# EAGLE design pcb for ps (EAGLE 9.6.2)
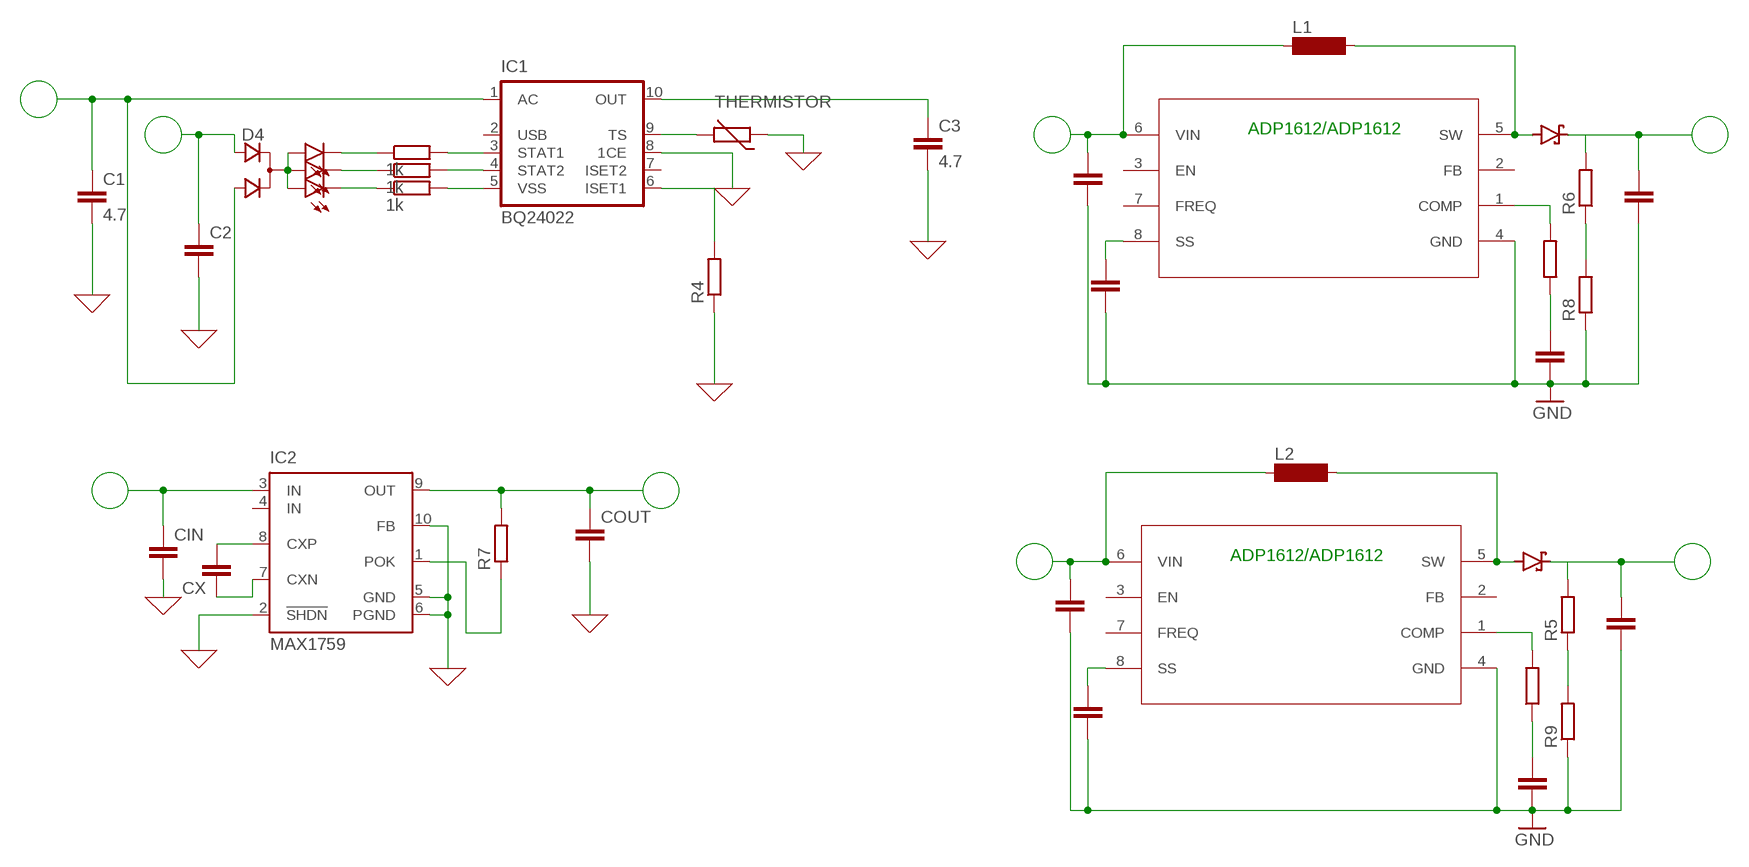
[diagram p0: schematic, sheet 1]

## Parts
C1  4.7  C2,5-3  [C2.5-3]
C2  C2,5-3  [C2.5-3]
C3  4.7  C2,5-3  [C2.5-3]
C4  C2,5-3  [C2.5-3]
C5  C2,5-3  [C2.5-3]
C6  C2,5-3  [C2.5-3]
C7  C2,5-3  [C2.5-3]
CIN  C2,5-3  [C2.5-3]
COUT  C2,5-3  [C2.5-3]
CSS  C2,5-3  [C2.5-3]
CSS1  C2,5-3  [C2.5-3]
CX  C2,5-3  [C2.5-3]
D1  SFH482  [SFH482]
D2  SFH482  [SFH482]
D3  SFH482  [SFH482]
D4  D_2ASOT23  [SOT-23]
D5  BAS40  [SOT23]
D6  BAS40  [SOT23]
IC1  BQ24022  [DRC-S-PVSON-N10]
IC2  MAX1759  [UMAX10]
IN  C2,5-3  [C2.5-3]
IN1  C2,5-3  [C2.5-3]
L1  BS11  [BS11]
L2  BS11  [BS11]
R1  1k  R-EU_0204/2V  [0204V]
R2  1k  R-EU_0204/2V  [0204V]
R3  1k  R-EU_0204/2V  [0204V]
R4  R-EU_0204/2V  [0204V]
R5  R-EU_0204/2V  [0204V]
R6  R-EU_0204/2V  [0204V]
R7  R-EU_0204/2V  [0204V]
R8  R-EU_0204/2V  [0204V]
R9  R-EU_0204/2V  [0204V]
RCOMP  R-EU_0204/2V  [0204V]
RCOMP1  R-EU_0204/2V  [0204V]
THERMISTOR  THERMISTOR_R-2,5  [RS-2,5]
U1  ADP1612  [RM_8_ADI]
U2  ADP1612  [RM_8_ADI]

## Nets
0: CIN.2 COUT.2 IC2.2(!SHDN) IC2.5(GND) IC2.6(PGND) IC2.10(FB) ; supply symbol labelled GND
GND: C4.2 C5.2 C6.2 C7.2 CSS1.2 CSS.2 IN1.2 IN.2 R8.1 R9.1 U1.4(GND) U2.4(GND)
N$1: C1.1 D4.3(A2) IC1.1(AC)
N$2: C2.1 D4.2(A1)
N$3: D1.A D2.A D3.A D4.1(C)
N$4: D1.K(C) R1.1
N$5: D2.K(C) R2.1
N$6: D3.K(C) R3.1
N$7: IC1.3(STAT1) R1.2
N$8: IC1.4(STAT2) R2.2
N$9: IC1.5(VSS) R3.2
N$10: IC1.9(TS) THERMISTOR.2
N$11: IN.1 L1.1 U1.6(VIN)
N$12: D5.1(A) L1.2 U1.5(SW)
N$13: IC1.6(ISET1) R4.2
N$14: C3.1 IC1.10(OUT)
N$15: IN1.1 L2.1 U2.6(VIN)
N$16: C6.1 RCOMP.1
N$17: RCOMP.2 U1.1(COMP)
N$18: CSS.1 U1.8(SS)
N$19: R6.2
N$20: C7.1 D5.3(C)
N$21: R6.1 R8.2
N$22: D6.1(A) L2.2 U2.5(SW)
N$23: CIN.1 IC2.3(IN)
N$24: CX.2 IC2.8(CXP)
N$25: CX.1 IC2.7(CXN)
N$26: COUT.1 IC2.9(OUT) R7.2
N$27: IC2.1(POK) R7.1
N$28: C4.1 RCOMP1.1
N$29: RCOMP1.2 U2.1(COMP)
N$30: CSS1.1 U2.8(SS)
N$31: R5.2
N$32: C5.1 D6.3(C)
N$33: R5.1 R9.2
THERMISTOR: C1.2 C2.2 C3.2 IC1.8(1CE) R4.1 THERMISTOR.1 ; supply symbol labelled GND
Unconnected: IC1.2(USB) IC1.7(ISET2) IC1.TH IC2.4(IN) U1.2(FB) U1.3(EN) U1.7(FREQ) U2.2(FB) U2.3(EN) U2.7(FREQ)

## Notes on the sheet
- ADP1612/ADP1612
- ADP1612/ADP1612

## Library data of the parts
C1-C7 CIN COUT CSS CSS1 CX IN IN1 = capacitor-wima:C: CAPACITOR naming: grid - package width
D1-D3 = led:SFH482: IR LED infrared emitting diode, Infineon
D4 = zetex:D_2A: Dual DIODE; OC_FARNELL: unknown; OC_NEWARK: unknown
D5 D6 = diode:BAS40: Silicon Schottky Diodes General-purpose diode for high-speed switching
IC1 = texas:BQ24022: SINGLE-CHIP, LI-ION AND LI-POL CHARGER IC WITH AUTONOMOUS USB-PORT AND AC-ADAPTER SUPPLY MANAGEMENT (bqTINY™-II) Source: bq24022.pdf (www.ti.com)
IC2 = maxim:MAX1759: Buck/Boost Regulating Charge Pump in µMAX Source: http://www.maxim-ic.com .. MAX1759.pdf; MF: MAXIM; MPN: MAX1759EUB+; OC_FARNELL: 1593325; OC_NEWARK: 61H9447
L1 L2 = inductor-neosid:BS: INDUCTOR nominal inductance, magnetically screened; OC_FARNELL: unknown; OC_NEWARK: unknown
R1-R9 RCOMP RCOMP1 = rcl:R-EU_: RESISTOR, European symbol; SPICEPREFIX: R
THERMISTOR = discrete:THERMISTOR_: Thermo Resistor
U1 U2 = ultra librarian:ADP1612: ADP 1612/1613 , ADP 1612, ADP1613, DC - DC step up converter; BUILT_BY: EMA_UL_Team; MANUFACTURER_PART_NUMBER: ADP1612ARMZ-R7; SOURCELIBRARY: Analog_2015-12-15; VENDOR: Analog Devices Inc

## Board
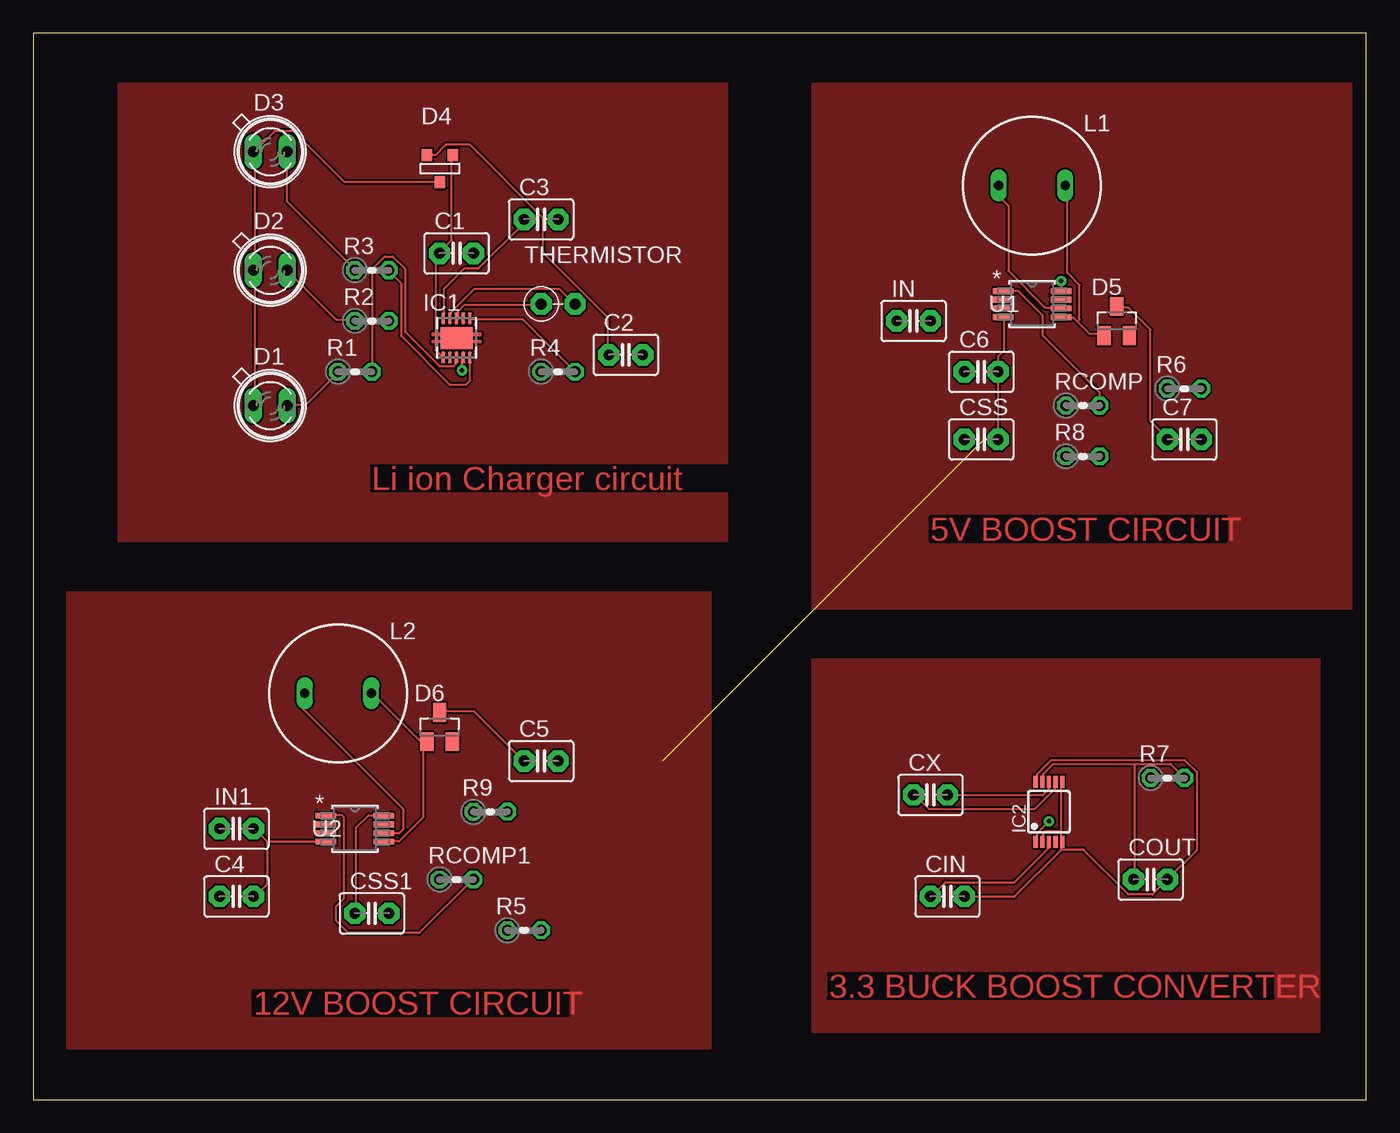
[diagram p1: board, top side]
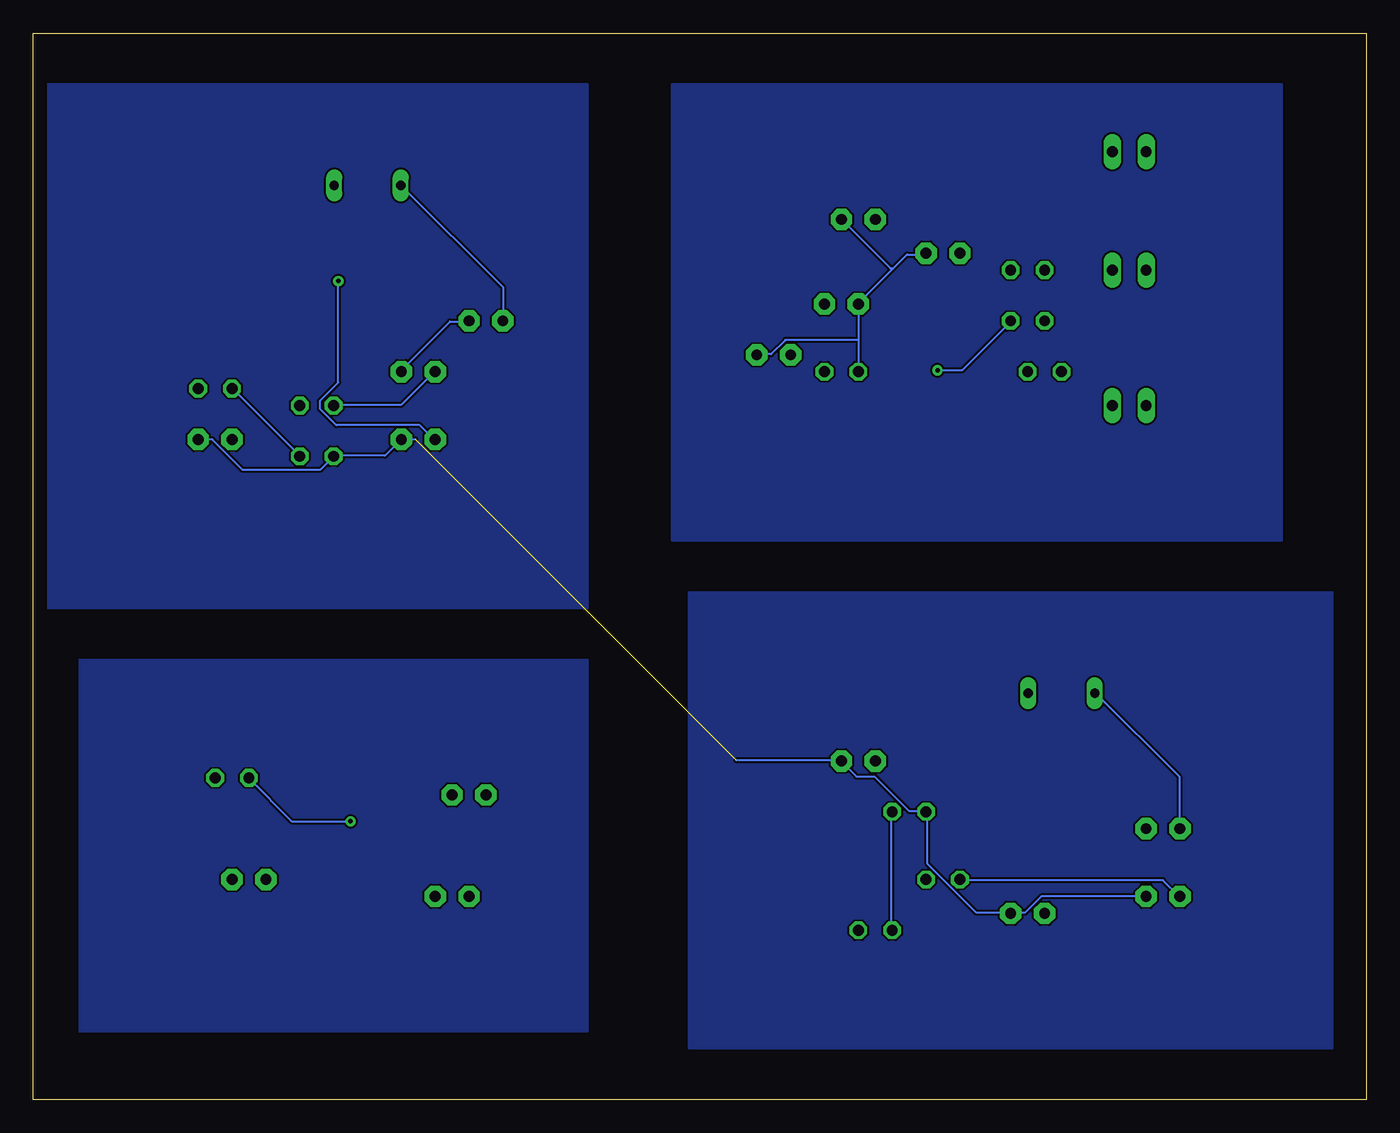
[diagram p2: board, bottom side, seen from below]

Size 100 x 80 mm. Coordinates in mm from the lower left corner, seen from the top.
Outline: 0,0 100,0 100,80 0,80 0,0
Copper layers (1*16): Top 0.035mm / dielectric 1.5mm / Bottom 0.035mm
Design rules "default": minimum track width 6mil, minimum drill 0.35mm, track to track 6mil, track to pad 6mil, pad to pad 6mil, via to via 6mil, smd to smd 6mil, copper to edge 40mil, drill to drill 6mil, minimum pad ring 10mil, minimum via ring 8mil, stop-mask expansion 4mil, vias tented up to drill 0mil, thermal gap 10mil

### Footprints (pad centres in the part's own frame; a part is rotated, then mirrored left to right if it is on the bottom)
C2.5-3 = drill 0.813 pad 1.6 octagon: 1 -1.27,0; 2 1.27,0
SFH482 = drill 0.813 long: A -1.27,0; K 1.27,0
SOT-23 = smd 0.787 x 0.889: 1 0.025,-1.016; 2 -0.94,1.016; 3 0.991,1.016
SOT23 = smd 1 x 1.4: 1 -0.95,-1.1; 2 0.95,-1.1; 3 0,1.1
DRC-S-PVSON-N10 = smd 0.28 x 0.85: 1 -1,-1.475; 2 -0.5,-1.475; 3 0,-1.475; 4 0.5,-1.475; 5 1,-1.475; 6 1,1.475; 7 0.5,1.475; 8 0,1.475; 9 -0.5,1.475; 10 -1,1.475 | smd 2.4 x 1.65: TH 0,0
UMAX10 = smd 0.32 x 0.9: 1 -1,-2.25; 2 -0.5,-2.25; 3 0,-2.25; 4 0.5,-2.25; 5 1,-2.25; 6 1,2.25; 7 0.5,2.25; 8 0,2.25; 9 -0.5,2.25; 10 -1,2.25
BS11 = drill 0.7 long: 1 -2.5,0; 2 2.5,0
0204V = drill 0.813 octagon: 1 -1.27,0; 2 1.27,0
RS-2,5 = drill 0.813 pad 1.6 octagon: 1 -1.27,0; 2 1.27,0
RM_8_ADI = smd 1.524 x 0.432: 1 -2.172,0.975; 2 -2.172,0.325; 3 -2.172,-0.325; 4 -2.172,-0.975; 5 2.172,-0.975; 6 2.172,-0.325; 7 2.172,0.325; 8 2.172,0.975

### Placement (x,y rotation side)
C1  31.75,63.5 0 top
C2  44.45,55.88 0 top
C3  38.1,66.04 0 top
C4  15.24,15.24 0 top
C5  38.1,25.4 0 top
C6  71.12,54.61 0 top
C7  86.36,49.53 0 top
CIN  68.58,15.24 0 top
COUT  83.82,16.51 0 top
CSS  71.12,49.53 0 top
CSS1  25.4,13.97 0 top
CX  67.31,22.86 0 top
D1  17.78,52.07 0 top
D2  17.78,62.23 0 top
D3  17.78,71.12 0 top
D4  30.48,69.85 0 top
D5  81.28,58.42 0 top
D6  30.48,27.94 0 top
IC1  31.75,57.15 0 top
IC2  76.2,21.59 0 top
IN  66.04,58.42 0 top
IN1  15.24,20.32 0 top
L1  74.93,68.58 0 top
L2  22.86,30.48 0 top
R1  24.13,54.61 0 top
R2  25.4,58.42 0 top
R3  25.4,62.23 0 top
R4  39.37,54.61 0 top
R5  36.83,12.7 0 top
R6  86.36,53.34 0 top
R7  85.09,24.13 0 top
R8  78.74,48.26 0 top
R9  34.29,21.59 0 top
RCOMP  78.74,52.07 0 top
RCOMP1  31.75,16.51 0 top
THERMISTOR  39.37,59.69 0 top
U1  74.93,59.69 0 top
U2  24.13,20.32 0 top

### Tracks (layer width: path | path; a pad name or v marks a point on that pad's centre or on a via)
0
  Top 0.152: 77.11,19.96 76.96,20.12 75.89,20.12 75.74,19.96 75.74,19.36 IC2.2 | 77.11,19.96 77.11,19.36 IC2.5 77.11,19.2 77.11,18.75 | 77.11,19.96 77.11,23.77 IC2.6 | 77.11,18.75 73.61,15.24 CIN.2 | IC2.10 75.29,23.93 75.29,24.38 76.35,25.45 86.41,25.45 87.33,24.54 87.33,18.75 COUT.2 83.97,15.39 82.14,15.39 78.79,18.75 77.11,18.75
BB
  pour Top: 58.42,33.02 58.42,5.08 96.52,5.08 96.52,33.02
BO
  pour Top: 2.54,38.1 50.8,38.1 50.8,3.81 2.54,3.81
BOOST
  pour Top: 58.42,76.2 58.42,36.83 99.06,36.83 99.06,76.2
CH
  pour Top: 6.35,76.2 6.35,41.91 52.07,41.91 52.07,76.2
F
  pour Bottom: 2.54,38.1 2.54,3.81 50.8,3.81 50.8,38.1
  pour Bottom: 58.42,33.02 58.42,5.08 96.52,5.08 96.52,33.02
G
  pour Bottom: 58.42,76.2 58.42,36.83 99.06,36.83 99.06,76.2
GND  (1 unrouted)
  Top 0.152: U1.4 72.85,58.67 72.85,56.24 72.39,55.78 C6.2 CSS.2 | 17.53,19.36 21.95,19.36 U2.4 | 17.53,19.36 16.61,20.27 IN1.2 | 17.53,19.36 17.53,16.15 16.61,15.24 C4.2
  Bottom 0.152: IN.2 67.36,58.37 68.73,58.37 72.39,54.71 C6.2 | C7.2 86.56,49.53 84.28,47.24 78.49,47.24 R8.1 77.42,48.31 73.61,48.31 CSS.2 71.32,49.53 | 26.67,14.02 25.6,14.02 24.38,15.24 C4.2 | 26.67,14.02 29.26,14.02 32.92,17.68 32.92,21.49 R9.1 33.07,21.64 34.29,21.64 36.88,24.23 38.25,24.23 39.32,25.3 C5.2 39.47,25.45 47.24,25.45 | 26.67,14.02 CSS1.2
H
  pour Bottom: 6.35,76.2 6.35,41.91 52.07,41.91 52.07,76.2
N$1
  Top 0.152: IC1.1 30.63,55.78 30.18,56.24 30.18,63.09 30.48,63.4 C1.1 30.48,63.55 31.39,64.47 31.39,70.87 D4.3
N$2
  Top 0.152: D4.2 30.18,70.87 30.94,71.63 32.77,71.63 38.25,66.14 38.25,63.55 43.13,58.67 43.13,55.93 C2.1
N$3
  Top 0.152: D1.A 16.61,52.12 16.61,62.18 D2.A 16.61,62.33 16.61,71.02 D3.A 16.61,71.17 18.14,72.69 19.51,72.69 23.32,68.89 30.48,68.89 D4.1
N$4
  Top 0.152: D1.K 19.05,52.12 20.42,52.12 22.86,54.56 R1.1
N$5
  Top 0.152: R2.1 24.08,58.52 22.71,58.52 19.05,62.18 D2.K
N$6
  Top 0.152: D3.K 19.05,67.36 24.08,62.33 R3.1
N$7
  Top 0.152: IC1.3 31.7,55.63 31.7,55.17 31.55,55.02 30.48,55.02 27.89,57.61 27.89,62.33 26.98,63.25 26.36,63.25 25.45,62.33 25.45,54.71 R1.2
N$8  (via drill 0.35)
  Top 0.152: v32.16,54.71 32.16,55.63 IC1.4
  Bottom 0.152: v32.16,54.71 30.33,54.71 26.67,58.37 R2.2
N$9
  Top 0.152: IC1.5 32.77,55.63 32.77,53.95 32.46,53.65 31.24,53.65 27.58,57.3 27.58,61.27 26.67,62.18 R3.2
N$10
  Top 0.152: IC1.9 31.24,58.67 31.24,58.98 33.07,60.81 39.47,60.81 40.54,59.74 THERMISTOR.2
N$11
  Top 0.152: U1.6 76.96,59.44 75.89,59.44 73.15,62.18 73.15,67.06 72.54,67.67 72.54,68.58 L1.1
  Bottom 0.152: IN.1 64.77,60.96 72.39,68.58 L1.1
N$12
  Top 0.152: 78.33,58.37 78.03,58.67 77.11,58.67 U1.5 | 78.33,58.37 79.25,57.45 80.31,57.45 D5.1 | 78.33,58.37 78.49,58.52 78.49,61.11 77.57,62.03 77.57,68.58 L1.2
N$13
  Top 0.152: R4.2 36.73,58.52 32.77,58.52 IC1.6
N$14
  Top 0.152: IC1.10 30.79,58.67 30.79,60.81 32.31,62.33 33.38,62.33 36.73,65.68 36.73,65.99 C3.1
N$15
  Top 0.152: U2.6 26.36,19.96 27.43,19.96 27.74,20.27 27.74,21.79 20.27,29.26 20.27,30.48 L2.1
  Bottom 0.152: IN1.1 14.02,20.42 14.02,24.23 20.27,30.48 L2.1
N$16
  Bottom 0.152: RCOMP.1 77.42,52.12 72.39,52.12 69.95,54.56 C6.1
N$17
  Top 0.152: RCOMP.2 80.01,53.03 75.74,57.3 75.74,58.83 73.91,60.66 72.85,60.66 U1.1
N$18  (via drill 0.35)
  Top 0.152: v77.11,61.42 77.11,60.81 U1.8
  Bottom 0.152: v77.11,61.42 77.11,53.8 78.49,52.43 78.49,51.82 77.27,50.6 71.02,50.6 69.95,49.53 CSS.1
N$20
  Top 0.152: D5.3 81.38,59.44 82.14,59.44 83.82,57.76 83.82,50.9 85.19,49.53 C7.1
N$21
  Bottom 0.152: R8.2 80.01,48.31 85.04,53.34 R6.1
N$22
  Top 0.152: 29.26,26.98 28.96,26.98 25.45,30.48 L2.2 | 29.26,26.98 29.41,26.98 D6.1 29.26,26.98 | 29.26,26.98 29.26,21.18 27.43,19.36 26.36,19.36 U2.5
N$23
  Top 0.152: IC2.3 76.2,18.9 73.61,16.31 68.43,16.31 67.36,15.24 CIN.1
N$24
  Top 0.152: IC2.8 76.2,23.32 75.74,22.86 CX.2
N$25
  Top 0.152: IC2.7 76.66,23.77 76.66,23.32 75.13,21.79 67.21,21.79 66.14,22.86 CX.1
N$26
  Top 0.152: 82.6,25.15 85.34,25.15 R7.2 | 82.6,25.15 76.5,25.15 75.74,24.38 75.74,23.93 IC2.9 | 82.6,25.15 82.6,16.61 COUT.1
N$27  (via drill 0.35)
  Top 0.152: v76.2,20.88 75.29,19.96 75.29,19.36 IC2.1
  Bottom 0.152: v76.2,20.88 80.62,20.88 83.82,24.08 R7.1
N$28
  Bottom 0.152: RCOMP1.1 30.48,16.46 15.24,16.46 14.02,15.24 C4.1
N$29
  Top 0.152: U2.1 22.1,21.34 23.16,21.34 23.32,21.18 23.32,15.09 22.71,14.48 22.71,13.41 23.62,12.5 28.96,12.5 32.92,16.46 RCOMP1.2
N$30
  Top 0.152: U2.8 26.21,21.34 25.15,21.34 24.23,20.42 24.23,14.02 CSS1.1
N$32
  Top 0.152: D6.3 30.48,29.11 33.07,29.11 36.73,25.45 C5.1
N$33
  Bottom 0.152: R5.1 35.66,12.8 35.66,21.49 R9.2
THERMISTOR
  Top 0.152: IC1.8 31.85,58.67 31.85,59.13 32.31,59.59 38.1,59.59 THERMISTOR.1
  Bottom 0.152: 38.1,57 THERMISTOR.1 38.1,59.74 35.51,62.33 | 38.1,57 R4.1 | 35.51,62.33 34.44,63.4 33.07,63.4 C1.2 | 38.1,57 43.59,57 44.65,55.93 45.72,55.93 C2.2 | C3.2 35.66,62.33 35.51,62.33

### Text on the board
Top: Li ion Charger circuit | 5V BOOST CIRCUIT | 3.3 BUCK BOOST CONVERTER | 12V BOOST CIRCUIT